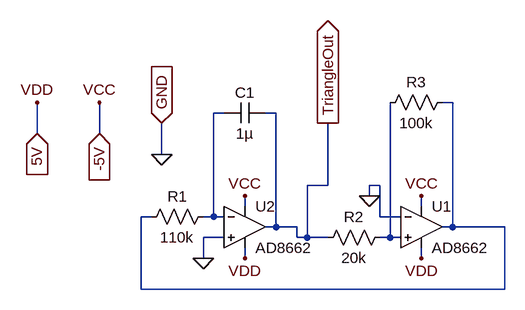
[diagram p0: schematic TriangleWaveGenerator.asc]
TriangleWaveGenerator.asc, the LTspice schematic file:
Version 4
SHEET 1 1072 680
WIRE 400 -64 384 -64
WIRE 48 -48 32 -48
WIRE 128 -48 112 -48
WIRE -240 -16 -240 -64
WIRE -144 -16 -144 -64
WIRE -48 16 -48 -32
WIRE 208 64 208 -32
WIRE 208 64 176 64
WIRE 288 64 272 64
WIRE 272 80 272 64
WIRE 80 96 80 80
WIRE 352 96 352 80
WIRE -64 112 -80 112
WIRE 32 112 32 -48
WIRE 32 112 16 112
WIRE 48 112 32 112
WIRE 288 112 288 64
WIRE 320 112 288 112
WIRE 128 128 128 -48
WIRE 128 128 112 128
WIRE 160 128 128 128
WIRE 400 128 400 -64
WIRE 400 128 384 128
WIRE 480 128 400 128
WIRE 48 144 16 144
WIRE 160 144 160 128
WIRE 176 144 176 64
WIRE 176 144 160 144
WIRE 208 144 176 144
WIRE 304 144 304 -64
WIRE 304 144 288 144
WIRE 320 144 304 144
WIRE 16 176 16 144
WIRE 80 176 80 160
WIRE 352 176 352 160
WIRE -80 224 -80 112
WIRE 480 224 480 128
WIRE 480 224 -80 224
FLAG 80 80 VCC
FLAG 352 80 VCC
FLAG -144 -64 VCC
FLAG 16 176 0
FLAG 272 80 0
FLAG 80 176 VDD
FLAG 352 176 VDD
FLAG -240 -64 VDD
FLAG 208 -32 TriangleOut
IOPIN 208 -32 Out
FLAG -240 -16 5V
IOPIN -240 -16 In
FLAG -144 -16 -5V
IOPIN -144 -16 In
FLAG -48 -32 GND
IOPIN -48 -32 In
FLAG -48 16 0
SYMBOL res 32 96 R90
WINDOW 0 0 56 VBottom 2
WINDOW 3 32 56 VTop 2
SYMATTR InstName R1
SYMATTR Value 110k
SYMBOL cap 112 -64 R90
WINDOW 0 0 32 VBottom 2
WINDOW 3 32 32 VTop 2
SYMATTR InstName C1
SYMATTR Value 1µ
SYMBOL res 400 -80 R90
WINDOW 0 0 56 VBottom 2
WINDOW 3 32 56 VTop 2
SYMATTR InstName R3
SYMATTR Value 100k
SYMBOL res 304 128 R90
WINDOW 0 0 56 VBottom 2
WINDOW 3 32 56 VTop 2
SYMATTR InstName R2
SYMATTR Value 20k
SYMBOL Opamps\\AD8662 352 64 R0
SYMATTR InstName U1
SYMBOL Opamps\\AD8662 80 64 R0
SYMATTR InstName U2

The netlist it stands for:
* TriangleWaveGenerator.asc
R1 N002 N001 110k
C1 TriangleOut N002 1µ
R3 N001 N003 100k
R2 N003 TriangleOut 20k
XU1 N003 0 -5V 5V N001 AD8662  ; pins In+ In- V+ V- OUT
XU2 0 N002 -5V 5V TriangleOut AD8662  ; pins In+ In- V+ V- OUT
.backanno
.end